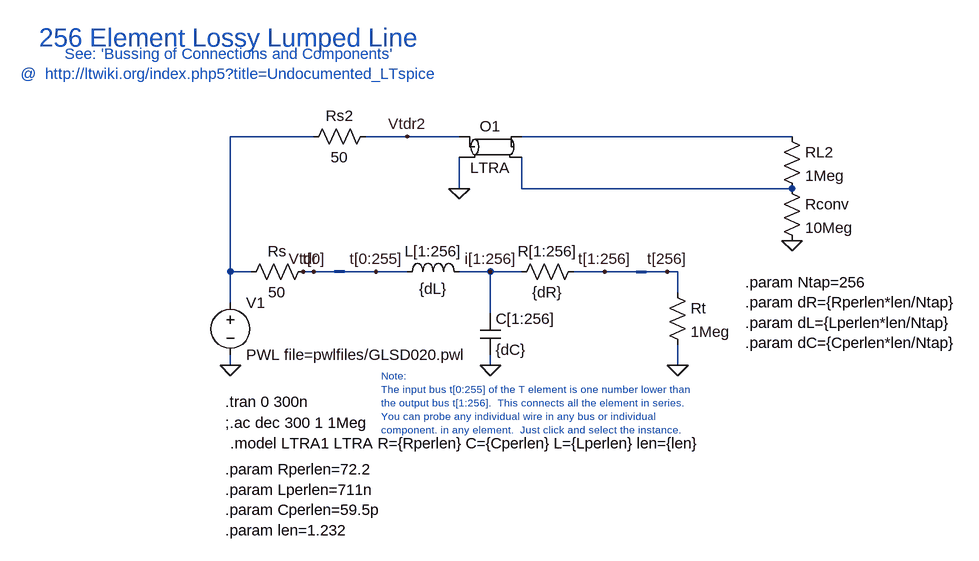
[diagram p0: schematic lumped_line_vs_ltra.asc]
lumped_line_vs_ltra.asc, the LTspice schematic file:
Version 4
SHEET 1 1668 680
WIRE 0 -128 -128 -128
WIRE 144 -128 80 -128
WIRE 224 -128 144 -128
WIRE 736 -128 320 -128
WIRE 224 -48 224 -96
WIRE 320 -48 320 -96
WIRE 736 -48 320 -48
WIRE -128 80 -128 -128
WIRE -96 80 -128 80
WIRE 0 80 -16 80
WIRE 32 80 0 80
WIRE 96 80 48 80
WIRE 144 80 96 80
WIRE 272 80 224 80
WIRE 320 80 272 80
WIRE 448 80 400 80
WIRE 496 80 448 80
WIRE 544 80 512 80
WIRE 560 80 544 80
WIRE 560 112 560 80
WIRE -128 128 -128 80
WIRE 272 144 272 80
WIRE -128 224 -128 208
WIRE 272 224 272 208
WIRE 560 224 560 192
FLAG -128 224 0
FLAG 272 224 0
FLAG 272 80 i[1:256]
FLAG 96 80 t[0:255]
FLAG 448 80 t[1:256]
FLAG 0 80 t[0]
FLAG 544 80 t[256]
FLAG 560 224 0
FLAG -16 80 Vtdr
FLAG 736 32 0
FLAG 224 -48 0
FLAG 144 -128 Vtdr2
BUSTAP 48 80 32 80
BUSTAP 496 80 512 80
SYMBOL res 416 64 R90
WINDOW 0 0 56 VBottom 2
WINDOW 3 32 56 VTop 2
SYMATTR InstName R[1:256]
SYMATTR Value {dR}
SYMBOL cap 256 144 R0
SYMATTR InstName C[1:256]
SYMATTR Value {dC}
SYMATTR SpiceLine Rser=0
SYMBOL ind 240 96 M270
WINDOW 0 32 56 VTop 2
WINDOW 3 5 56 VBottom 2
SYMATTR InstName L[1:256]
SYMATTR Value {dL}
SYMATTR SpiceLine Rser=0
SYMBOL res 0 64 R90
WINDOW 0 0 56 VBottom 2
WINDOW 3 32 56 VTop 2
SYMATTR InstName Rs
SYMATTR Value 50
SYMBOL res 544 96 R0
SYMATTR InstName Rt
SYMATTR Value 1Meg
SYMBOL voltage -128 112 R0
SYMATTR InstName V1
SYMATTR Value PWL file=pwlfiles/GLSD020.pwl
SYMBOL ltline 272 -112 R0
SYMATTR InstName O1
SYMATTR SpiceModel LTRA1
SYMBOL res 720 -144 R0
SYMATTR InstName RL2
SYMATTR Value 1Meg
SYMBOL res 720 -64 R0
SYMATTR InstName Rconv
SYMATTR Value 10Meg
SYMBOL res 96 -144 R90
WINDOW 0 0 56 VBottom 2
WINDOW 3 32 56 VTop 2
SYMATTR InstName Rs2
SYMATTR Value 50
TEXT -136 280 Left 2 !.tran 0 300n
TEXT -136 312 Left 2 !;.ac dec 300 1 1Meg
TEXT -128 -280 Center 4 ;256 Element Lossy Lumped Line
TEXT -128 -240 Center 2 ;See: 'Bussing of Connections and Components'\n@  http://ltwiki.org/index.php5?title=Undocumented_LTspice
TEXT 104 240 Left 1 ;Note: \nThe input bus t[0:255] of the T element is one number lower than \nthe output bus t[1:256].  This connects all the element in series.\nYou can probe any individual wire in any bus or individual \ncomponent. in any element.  Just click and select the instance.
TEXT -128 344 Left 2 !.model LTRA1 LTRA R={Rperlen} C={Cperlen} L={Lperlen} len={len}
TEXT -136 384 Left 2 !.param Rperlen=72.2\n.param Lperlen=711n\n.param Cperlen=59.5p\n.param len=1.232
TEXT 664 96 Left 2 !.param Ntap=256\n.param dR={Rperlen*len/Ntap}\n.param dL={Lperlen*len/Ntap}\n.param dC={Cperlen*len/Ntap}

The netlist it stands for:
* lumped_line_vs_ltra.asc
R[1:256] t[1:256] i[1:256] {dR}
C[1:256] i[1:256] 0 {dC} Rser=0
L[1:256] i[1:256] t[0:255] {dL} Rser=0
Rs Vtdr N001 50
Rt t[256] 0 1Meg
V1 N001 0 PWL file=pwlfiles/GLSD020.pwl
O1 Vtdr2 0 N002 N003 LTRA1 LTRA
RL2 N002 N003 1Meg
Rconv N003 0 10Meg
Rs2 Vtdr2 N001 50
.tran 0 300n
;.ac dec 300 1 1Meg
* 256 Element Lossy Lumped Line
* See: 'Bussing of Connections and Components'
* @  http://ltwiki.org/index.php5?title=Undocumented_LTspice
* Note:
* The input bus t[0:255] of the T element is one number lower than
* the output bus t[1:256].  This connects all the element in series.
* You can probe any individual wire in any bus or individual
* component. in any element.  Just click and select the instance.
.model LTRA1 LTRA R={Rperlen} C={Cperlen} L={Lperlen} len={len}
.param Rperlen=72.2
.param Lperlen=711n
.param Cperlen=59.5p
.param len=1.232
.param Ntap=256
.param dR={Rperlen*len/Ntap}
.param dL={Lperlen*len/Ntap}
.param dC={Cperlen*len/Ntap}
.backanno
.end